# Altium project SVPXGR740_3U.PrjPcb (part 4 of 8)

## Sheet SDRAM.SchDoc
size A3
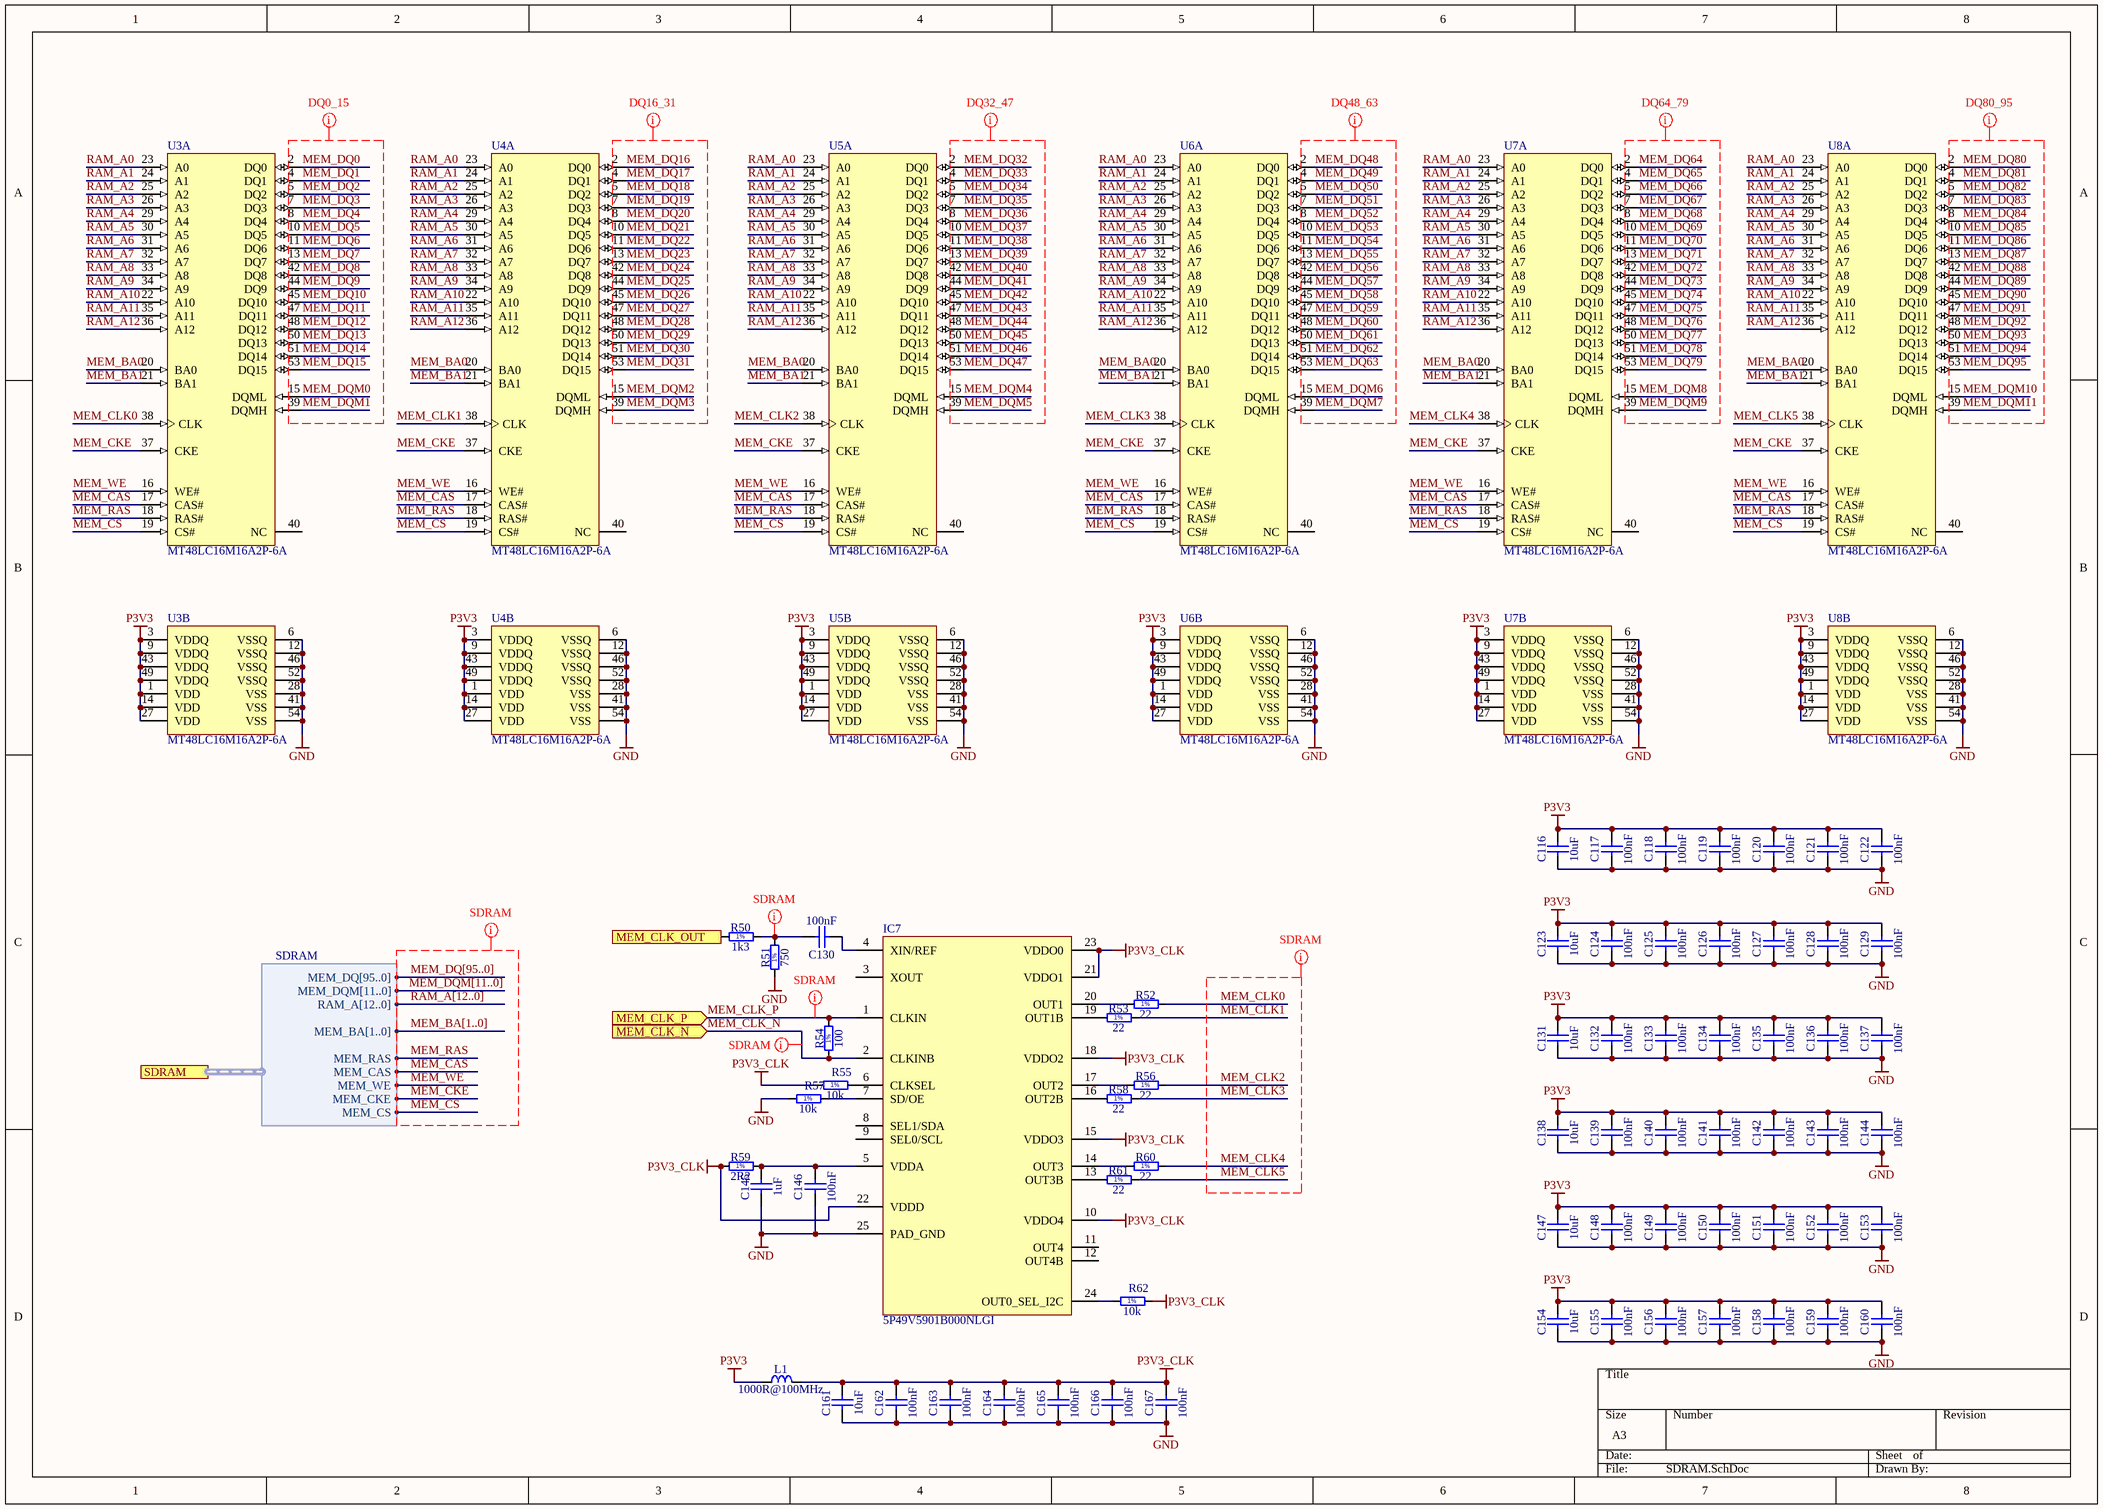
[diagram p11: SDRAM.SchDoc]

### Parts
C116  10uF  [CAPC2012X135N]
C117  100nF  [CAPC0603X33N]
C118  100nF  [CAPC0603X33N]
C119  100nF  [CAPC0603X33N]
C120  100nF  [CAPC0603X33N]
C121  100nF  [CAPC0603X33N]
C122  100nF  [CAPC0603X33N]
C123  10uF  [CAPC2012X135N]
C124  100nF  [CAPC0603X33N]
C125  100nF  [CAPC0603X33N]
C126  100nF  [CAPC0603X33N]
C127  100nF  [CAPC0603X33N]
C128  100nF  [CAPC0603X33N]
C129  100nF  [CAPC0603X33N]
C130  100nF  [CAPC0603X33N]
C131  10uF  [CAPC2012X135N]
C132  100nF  [CAPC0603X33N]
C133  100nF  [CAPC0603X33N]
C134  100nF  [CAPC0603X33N]
C135  100nF  [CAPC0603X33N]
C136  100nF  [CAPC0603X33N]
C137  100nF  [CAPC0603X33N]
C138  10uF  [CAPC2012X135N]
C139  100nF  [CAPC0603X33N]
C140  100nF  [CAPC0603X33N]
C141  100nF  [CAPC0603X33N]
C142  100nF  [CAPC0603X33N]
C143  100nF  [CAPC0603X33N]
C144  100nF  [CAPC0603X33N]
C145  1uF  [CAPC1005X55N]
C146  100nF  [CAPC0603X33N]
C147  10uF  [CAPC2012X135N]
C148  100nF  [CAPC0603X33N]
C149  100nF  [CAPC0603X33N]
C150  100nF  [CAPC0603X33N]
C151  100nF  [CAPC0603X33N]
C152  100nF  [CAPC0603X33N]
C153  100nF  [CAPC0603X33N]
C154  10uF  [CAPC2012X135N]
C155  100nF  [CAPC0603X33N]
C156  100nF  [CAPC0603X33N]
C157  100nF  [CAPC0603X33N]
C158  100nF  [CAPC0603X33N]
C159  100nF  [CAPC0603X33N]
C160  100nF  [CAPC0603X33N]
C161  10uF  [CAPC2012X135N]
C162  100nF  [CAPC0603X33N]
C163  100nF  [CAPC0603X33N]
C164  100nF  [CAPC0603X33N]
C165  100nF  [CAPC0603X33N]
C166  100nF  [CAPC0603X33N]
C167  100nF  [CAPC0603X33N]
IC7  5P49V5901B000NLGI  [QFN50P400X400X100-25N-S280]
L1  1000R@100MHz  [INDC1608X95N]
R50  1k3  [RESC1005X40N]
R51  750  [RESC1005X40N]
R52  22  [RESC1005X40N]
R53  22  [RESC1005X40N]
R54  100  [RESC1005X40N]
R55  10k  [RESC1005X40N]
R56  22  [RESC1005X40N]
R57  10k  [RESC1005X40N]
R58  22  [RESC1005X40N]
R59  2R2  [RESC1005X40N]
R60  22  [RESC1005X40N]
R61  22  [RESC1005X40N]
R62  10k  [RESC1005X40N]
U3  MT48LC16M16A2P-6A  [MICT-P-54_N]  (parts A,B of 2)
U4  MT48LC16M16A2P-6A  [MICT-P-54_N]  (parts A,B of 2)
U5  MT48LC16M16A2P-6A  [MICT-P-54_N]  (parts A,B of 2)
U6  MT48LC16M16A2P-6A  [MICT-P-54_N]  (parts A,B of 2)
U7  MT48LC16M16A2P-6A  [MICT-P-54_N]  (parts A,B of 2)
U8  MT48LC16M16A2P-6A  [MICT-P-54_N]  (parts A,B of 2)

### Ports
MEM_CLK_N (in), MEM_CLK_OUT (in), MEM_CLK_P (in), SDRAM (harness SDRAM)

### Harnesses
SDRAM: MEM_DQ[95..0], MEM_DQM[11..0], RAM_A[12..0], MEM_BA[1..0], MEM_RAS, MEM_CAS, MEM_WE, MEM_CKE, MEM_CS

### Nets
GND: C116.1 C117.2 C118.2 C119.2 C120.2 C121.2 C122.2 C123.1 C124.2 C125.2 C126.2 C127.2 C128.2 C129.2 C131.1 C132.2 C133.2 C134.2 C135.2 C136.2 C137.2 C138.1 C139.2 C140.2 C141.2 C142.2 C143.2 C144.2 C145.1 C146.2 C147.1 C148.2 C149.2 C150.2 C151.2 C152.2 C153.2 C154.1 C155.2 C156.2 C157.2 C158.2 C159.2 C160.2 C161.1 C162.2 C163.2 C164.2 C165.2 C166.2 C167.2 IC7.25(PAD_GND) R51.1 R57.1 U3.6(VSSQ) U3.12(VSSQ) U3.28(VSS) U3.41(VSS) U3.46(VSSQ) U3.52(VSSQ) U3.54(VSS) U4.6(VSSQ) U4.12(VSSQ) U4.28(VSS) U4.41(VSS) U4.46(VSSQ) U4.52(VSSQ) U4.54(VSS) U5.6(VSSQ) U5.12(VSSQ) U5.28(VSS) U5.41(VSS) U5.46(VSSQ) U5.52(VSSQ) U5.54(VSS) U6.6(VSSQ) U6.12(VSSQ) U6.28(VSS) U6.41(VSS) U6.46(VSSQ) U6.52(VSSQ) U6.54(VSS) U7.6(VSSQ) U7.12(VSSQ) U7.28(VSS) U7.41(VSS) U7.46(VSSQ) U7.52(VSSQ) U7.54(VSS) U8.6(VSSQ) U8.12(VSSQ) U8.28(VSS) U8.41(VSS) U8.46(VSSQ) U8.52(VSSQ) U8.54(VSS)
P3V3: C116.2 C117.1 C118.1 C119.1 C120.1 C121.1 C122.1 C123.2 C124.1 C125.1 C126.1 C127.1 C128.1 C129.1 C131.2 C132.1 C133.1 C134.1 C135.1 C136.1 C137.1 C138.2 C139.1 C140.1 C141.1 C142.1 C143.1 C144.1 C147.2 C148.1 C149.1 C150.1 C151.1 C152.1 C153.1 C154.2 C155.1 C156.1 C157.1 C158.1 C159.1 C160.1 L1.1 U3.1(VDD) U3.3(VDDQ) U3.9(VDDQ) U3.14(VDD) U3.27(VDD) U3.43(VDDQ) U3.49(VDDQ) U4.1(VDD) U4.3(VDDQ) U4.9(VDDQ) U4.14(VDD) U4.27(VDD) U4.43(VDDQ) U4.49(VDDQ) U5.1(VDD) U5.3(VDDQ) U5.9(VDDQ) U5.14(VDD) U5.27(VDD) U5.43(VDDQ) U5.49(VDDQ) U6.1(VDD) U6.3(VDDQ) U6.9(VDDQ) U6.14(VDD) U6.27(VDD) U6.43(VDDQ) U6.49(VDDQ) U7.1(VDD) U7.3(VDDQ) U7.9(VDDQ) U7.14(VDD) U7.27(VDD) U7.43(VDDQ) U7.49(VDDQ) U8.1(VDD) U8.3(VDDQ) U8.9(VDDQ) U8.14(VDD) U8.27(VDD) U8.43(VDDQ) U8.49(VDDQ)  [project net 3.3V]
P3V3_CLK: C161.2 C162.1 C163.1 C164.1 C165.1 C166.1 C167.1 IC7.10(VDDO4) IC7.15(VDDO3) IC7.18(VDDO2) IC7.21(VDDO1) IC7.22(VDDD) IC7.23(VDDO0) L1.2 R55.1 R59.1 R62.2
MEM_BA0: U3.20(BA0) U4.20(BA0) U5.20(BA0) U6.20(BA0) U7.20(BA0) U8.20(BA0)
MEM_BA1: U3.21(BA1) U4.21(BA1) U5.21(BA1) U6.21(BA1) U7.21(BA1) U8.21(BA1)
MEM_CAS: U3.17(CAS#) U4.17(CAS#) U5.17(CAS#) U6.17(CAS#) U7.17(CAS#) U8.17(CAS#) ; port SDRAM.MEM_CAS
MEM_CKE: U3.37(CKE) U4.37(CKE) U5.37(CKE) U6.37(CKE) U7.37(CKE) U8.37(CKE) ; port SDRAM.MEM_CKE
MEM_CLK0: R52.2 U3.38(CLK)
MEM_CLK1: R53.2 U4.38(CLK)
MEM_CLK2: R56.2 U5.38(CLK)
MEM_CLK3: R58.2 U6.38(CLK)
MEM_CLK4: R60.2 U7.38(CLK)
MEM_CLK5: R61.2 U8.38(CLK)
MEM_CLK_N: IC7.2(CLKINB) R54.1 ; port MEM_CLK_N
MEM_CLK_OUT: R50.1 ; port MEM_CLK_OUT
MEM_CLK_P: IC7.1(CLKIN) R54.2 ; port MEM_CLK_P
MEM_CS: U3.19(CS#) U4.19(CS#) U5.19(CS#) U6.19(CS#) U7.19(CS#) U8.19(CS#) ; port SDRAM.MEM_CS
MEM_DQ0: U3.2(DQ0)
MEM_DQ1: U3.4(DQ1)
MEM_DQ2: U3.5(DQ2)
MEM_DQ3: U3.7(DQ3)
MEM_DQ4: U3.8(DQ4)
MEM_DQ5: U3.10(DQ5)
MEM_DQ6: U3.11(DQ6)
MEM_DQ7: U3.13(DQ7)
MEM_DQ8: U3.42(DQ8)
MEM_DQ9: U3.44(DQ9)
MEM_DQ10: U3.45(DQ10)
MEM_DQ11: U3.47(DQ11)
MEM_DQ12: U3.48(DQ12)
MEM_DQ13: U3.50(DQ13)
MEM_DQ14: U3.51(DQ14)
MEM_DQ15: U3.53(DQ15)
MEM_DQ16: U4.2(DQ0)
MEM_DQ17: U4.4(DQ1)
MEM_DQ18: U4.5(DQ2)
MEM_DQ19: U4.7(DQ3)
MEM_DQ20: U4.8(DQ4)
MEM_DQ21: U4.10(DQ5)
MEM_DQ22: U4.11(DQ6)
MEM_DQ23: U4.13(DQ7)
MEM_DQ24: U4.42(DQ8)
MEM_DQ25: U4.44(DQ9)
MEM_DQ26: U4.45(DQ10)
MEM_DQ27: U4.47(DQ11)
MEM_DQ28: U4.48(DQ12)
MEM_DQ29: U4.50(DQ13)
MEM_DQ30: U4.51(DQ14)
MEM_DQ31: U4.53(DQ15)
MEM_DQ32: U5.2(DQ0)
MEM_DQ33: U5.4(DQ1)
MEM_DQ34: U5.5(DQ2)
MEM_DQ35: U5.7(DQ3)
MEM_DQ36: U5.8(DQ4)
MEM_DQ37: U5.10(DQ5)
MEM_DQ38: U5.11(DQ6)
MEM_DQ39: U5.13(DQ7)
MEM_DQ40: U5.42(DQ8)
MEM_DQ41: U5.44(DQ9)
MEM_DQ42: U5.45(DQ10)
MEM_DQ43: U5.47(DQ11)
MEM_DQ44: U5.48(DQ12)
MEM_DQ45: U5.50(DQ13)
MEM_DQ46: U5.51(DQ14)
MEM_DQ47: U5.53(DQ15)
MEM_DQ48: U6.2(DQ0)
MEM_DQ49: U6.4(DQ1)
MEM_DQ50: U6.5(DQ2)
MEM_DQ51: U6.7(DQ3)
MEM_DQ52: U6.8(DQ4)
MEM_DQ53: U6.10(DQ5)
MEM_DQ54: U6.11(DQ6)
MEM_DQ55: U6.13(DQ7)
MEM_DQ56: U6.42(DQ8)
MEM_DQ57: U6.44(DQ9)
MEM_DQ58: U6.45(DQ10)
MEM_DQ59: U6.47(DQ11)
MEM_DQ60: U6.48(DQ12)
MEM_DQ61: U6.50(DQ13)
MEM_DQ62: U6.51(DQ14)
MEM_DQ63: U6.53(DQ15)
MEM_DQ64: U7.2(DQ0)
MEM_DQ65: U7.4(DQ1)
MEM_DQ66: U7.5(DQ2)
MEM_DQ67: U7.7(DQ3)
MEM_DQ68: U7.8(DQ4)
MEM_DQ69: U7.10(DQ5)
MEM_DQ70: U7.11(DQ6)
MEM_DQ71: U7.13(DQ7)
MEM_DQ72: U7.42(DQ8)
MEM_DQ73: U7.44(DQ9)
MEM_DQ74: U7.45(DQ10)
MEM_DQ75: U7.47(DQ11)
MEM_DQ76: U7.48(DQ12)
MEM_DQ77: U7.50(DQ13)
MEM_DQ78: U7.51(DQ14)
MEM_DQ79: U7.53(DQ15)
MEM_DQ80: U8.2(DQ0)
MEM_DQ81: U8.4(DQ1)
MEM_DQ82: U8.5(DQ2)
MEM_DQ83: U8.7(DQ3)
MEM_DQ84: U8.8(DQ4)
MEM_DQ85: U8.10(DQ5)
MEM_DQ86: U8.11(DQ6)
MEM_DQ87: U8.13(DQ7)
MEM_DQ88: U8.42(DQ8)
MEM_DQ89: U8.44(DQ9)
MEM_DQ90: U8.45(DQ10)
MEM_DQ91: U8.47(DQ11)
MEM_DQ92: U8.48(DQ12)
MEM_DQ93: U8.50(DQ13)
MEM_DQ94: U8.51(DQ14)
MEM_DQ95: U8.53(DQ15)
MEM_DQM0: U3.15(DQML)
MEM_DQM1: U3.39(DQMH)
MEM_DQM2: U4.15(DQML)
MEM_DQM3: U4.39(DQMH)
MEM_DQM4: U5.15(DQML)
MEM_DQM5: U5.39(DQMH)
MEM_DQM6: U6.15(DQML)
MEM_DQM7: U6.39(DQMH)
MEM_DQM8: U7.15(DQML)
MEM_DQM9: U7.39(DQMH)
MEM_DQM10: U8.15(DQML)
MEM_DQM11: U8.39(DQMH)
MEM_RAS: U3.18(RAS#) U4.18(RAS#) U5.18(RAS#) U6.18(RAS#) U7.18(RAS#) U8.18(RAS#) ; port SDRAM.MEM_RAS
MEM_WE: U3.16(WE#) U4.16(WE#) U5.16(WE#) U6.16(WE#) U7.16(WE#) U8.16(WE#) ; port SDRAM.MEM_WE
RAM_A0: U3.23(A0) U4.23(A0) U5.23(A0) U6.23(A0) U7.23(A0) U8.23(A0)
RAM_A1: U3.24(A1) U4.24(A1) U5.24(A1) U6.24(A1) U7.24(A1) U8.24(A1)
RAM_A2: U3.25(A2) U4.25(A2) U5.25(A2) U6.25(A2) U7.25(A2) U8.25(A2)
RAM_A3: U3.26(A3) U4.26(A3) U5.26(A3) U6.26(A3) U7.26(A3) U8.26(A3)
RAM_A4: U3.29(A4) U4.29(A4) U5.29(A4) U6.29(A4) U7.29(A4) U8.29(A4)
RAM_A5: U3.30(A5) U4.30(A5) U5.30(A5) U6.30(A5) U7.30(A5) U8.30(A5)
RAM_A6: U3.31(A6) U4.31(A6) U5.31(A6) U6.31(A6) U7.31(A6) U8.31(A6)
RAM_A7: U3.32(A7) U4.32(A7) U5.32(A7) U6.32(A7) U7.32(A7) U8.32(A7)
RAM_A8: U3.33(A8) U4.33(A8) U5.33(A8) U6.33(A8) U7.33(A8) U8.33(A8)
RAM_A9: U3.34(A9) U4.34(A9) U5.34(A9) U6.34(A9) U7.34(A9) U8.34(A9)
RAM_A10: U3.22(A10) U4.22(A10) U5.22(A10) U6.22(A10) U7.22(A10) U8.22(A10)
RAM_A11: U3.35(A11) U4.35(A11) U5.35(A11) U6.35(A11) U7.35(A11) U8.35(A11)
RAM_A12: U3.36(A12) U4.36(A12) U5.36(A12) U6.36(A12) U7.36(A12) U8.36(A12)
NetC130_1: C130.1 R50.2 R51.2
NetC130_2: C130.2 IC7.4(XIN/REF)
NetC145_2: C145.2 C146.1 IC7.5(VDDA) R59.2
NetIC7_6: IC7.6(CLKSEL) R55.2
NetIC7_7: IC7.7(SD/OE) R57.2
NetIC7_13: IC7.13(OUT3B) R61.1
NetIC7_14: IC7.14(OUT3) R60.1
NetIC7_16: IC7.16(OUT2B) R58.1
NetIC7_17: IC7.17(OUT2) R56.1
NetIC7_19: IC7.19(OUT1B) R53.1
NetIC7_20: IC7.20(OUT1) R52.1
NetIC7_24: IC7.24(OUT0_SEL_I2C) R62.1

Not connected (* = marked no-connect by the designer): IC7 3(XOUT) 8(SEL1/SDA) 9(SEL0/SCL) 11(OUT4) 12(OUT4B); U3 40(NC); U4 40(NC); U5 40(NC); U6 40(NC); U7 40(NC); U8 40(NC)

### Buses and harness runs
bus MEM_BA[1..0]
bus MEM_DQ[95..0]
bus MEM_DQM[11..0]
bus RAM_A[12..0]

### Layout directives
net class DQ0_15: MEM_DQ0, MEM_DQ1, MEM_DQ2, MEM_DQ3, MEM_DQ4, MEM_DQ5, MEM_DQ6, MEM_DQ7, MEM_DQ8, MEM_DQ9, MEM_DQ10, MEM_DQ11, MEM_DQ12, MEM_DQ13, MEM_DQ14, MEM_DQ15, MEM_DQM0, MEM_DQM1
net class DQ16_31: MEM_DQ16, MEM_DQ17, MEM_DQ18, MEM_DQ19, MEM_DQ20, MEM_DQ21, MEM_DQ22, MEM_DQ23, MEM_DQ24, MEM_DQ25, MEM_DQ26, MEM_DQ27, MEM_DQ28, MEM_DQ29, MEM_DQ30, MEM_DQ31, MEM_DQM2, MEM_DQM3
net class DQ32_47: MEM_DQ32, MEM_DQ33, MEM_DQ34, MEM_DQ35, MEM_DQ36, MEM_DQ37, MEM_DQ38, MEM_DQ39, MEM_DQ40, MEM_DQ41, MEM_DQ42, MEM_DQ43, MEM_DQ44, MEM_DQ45, MEM_DQ46, MEM_DQ47, MEM_DQM4, MEM_DQM5
net class DQ48_63: MEM_DQ48, MEM_DQ49, MEM_DQ50, MEM_DQ51, MEM_DQ52, MEM_DQ53, MEM_DQ54, MEM_DQ55, MEM_DQ56, MEM_DQ57, MEM_DQ58, MEM_DQ59, MEM_DQ60, MEM_DQ61, MEM_DQ62, MEM_DQ63, MEM_DQM6, MEM_DQM7
net class DQ64_79: MEM_DQ64, MEM_DQ65, MEM_DQ66, MEM_DQ67, MEM_DQ68, MEM_DQ69, MEM_DQ70, MEM_DQ71, MEM_DQ72, MEM_DQ73, MEM_DQ74, MEM_DQ75, MEM_DQ76, MEM_DQ77, MEM_DQ78, MEM_DQ79, MEM_DQM8, MEM_DQM9
net class DQ80_95: MEM_DQ80, MEM_DQ81, MEM_DQ82, MEM_DQ83, MEM_DQ84, MEM_DQ85, MEM_DQ86, MEM_DQ87, MEM_DQ88, MEM_DQ89, MEM_DQ90, MEM_DQ91, MEM_DQ92, MEM_DQ93, MEM_DQ94, MEM_DQ95, MEM_DQM10, MEM_DQM11
rule Width Constraint [Pref Impedance = 50.00ohms    Min Impedance = 50.00ohms    Max Impedance = 50.00ohms]; net class SDRAM: MEM_BA[1..0], MEM_CAS, MEM_CKE, MEM_CLK0, MEM_CLK1, MEM_CLK2, MEM_CLK3, MEM_CLK4, MEM_CLK5, MEM_CLK_N, MEM_CLK_P, MEM_CS, MEM_DQ[95..0], MEM_DQM[11..0], MEM_RAS, MEM_WE, NetC130_1, RAM_A[12..0]

### Notes on the sheet
- (in symbol R0402_1K3_1%_0.0625W_100PPM) 1%
- (in symbol R0402_2R2_1%_0.0625W_200PPM) 1%
- (in symbol R0402_10K_1%_0.0625W_100PPM) 1%
- (in symbol R0402_22R_1%_0.0625W_100PPM) 1%
- (in symbol R0402_100R_1%_0.0625W_100PPM) 1%
- (in symbol R0402_750R_1%_0.0625W_100PPM) 1%

### Library data of the parts
C116 C123 C131 C138 C147 C154 C161 = CC0805_10UF_16V_10%_X5R: as C46 on sheet GR740_Power; Part Number: CC0805_10UF_16V_10%_X5R; Component Kind: Standard; Component Type: Standard; Pin Count: 2; Value: 10uF; Status: Preferred; Manufacturer Part Number: CC0805_10UF_16V_10%_X5R; Case: 0805; Mounted: Yes; Socket: No; SMD: Yes; Sense: No; Manufacturer1 Example: KEMET; Manufacturer1 ComponentHeight: 1.4mm; HelpURL: \\cern.ch\dfs\Applications\Altium\Datasheets\CC1206_X5R_KEMET.pdf; Author: CERN DEM JLC; CreateDate: 03.12.2007; LatestRevisionDate: 03.12.2007
C117-C122 C124-C130 C132-C137 C139-C144 C146 C148-C153 C155-C160 C162-C167 = CC0201_100NF_6.3V_10%_X5R: as C15 on sheet GR740_Power; Part Number: CC0201_100NF_6.3V_10%_X5R; Component Kind: Standard; Component Type: Standard; Pin Count: 2; Value: 100nF; Status: Not Recommended; Manufacturer Part Number: CC0201_100NF_6.3V_10%_X5R; Case: 0201; Mounted: Yes; Socket: No; SMD: Yes; Sense: No; Manufacturer1 Example: AVX; Manufacturer1 ComponentHeight: 0.33mm; HelpURL: \\cern.ch\dfs\Applications\Altium\Datasheets\CC0201_X5R_AVX.pdf; Author: CERN DEM JLC; CreateDate: 03/12/2007; LatestRevisionDate: 03/12/2007
C145 = CC0402_1UF_16V_10%_X5R: Non-polarised capacitor; Part Description: SMD Multilayer Chip Ceramic Capacitor; Manufacturer: GENERIC; Manufacturer1 Part Number: C1005X5R1C105KT; Voltage: 16V; TC: X5R; Tolerance: ±10%; Part Number: CC0402_1UF_16V_10%_X5R; Component Kind: Standard; Component Type: Standard; Pin Count: 2; Value: 1uF; Status: Preferred; Manufacturer Part Number: CC0402_1UF_16V_10%_X5R; Case: 0402; Mounted: Yes; Socket: No; SMD: Yes; Sense: No; Manufacturer1 Example: TDK; Manufacturer1 ComponentHeight: 0.55mm; HelpURL: \\cern.ch\dfs\Applications\Altium\Datasheets\CC0402_X5R_TDK_C.pdf; Author: CERN DEM JLC; CreateDate: 25.10.2012; LatestRevisionDate: 25.10.2012
L1 = IND0603_MURATA_BLM18HE102SN1: Inductor; Part Description: SMD EMIFIL Suppression Chip Ferrite Bead; Manufacturer: MURATA; Power: 600mA; Resistance: 0.35R; Tolerance: ±25%; Part Number: IND0603_MURATA_BLM18HE102SN1; Component Kind: Standard; Component Type: Standard; Pin Count: 2; Value: 1000R@100MHz; Status: None; Manufacturer Part Number: BLM18HE102SN1; Case: 0603; Mounted: Yes; Socket: No; SMD: Yes; Sense: No; ComponentHeight: 0.95mm; HelpURL: \\cern.ch\dfs\Applications\Altium\Datasheets\IND0603_MURATA_BLM18H.pdf; Author: CERN DEM JLC; CreateDate: 09/12/2013; LatestRevisionDate: 09/12/2013
R50 = R0402_1K3_1%_0.0625W_100PPM: Resistor - 1%; Part Description: General Purpose Thick Film Chip Resistor; Manufacturer: GENERIC; Manufacturer1 Part Number: 232270671302L; TC: ±100ppm/°C; PressFit: No; Part Number: R0402_1K3_1%_0.0625W_100PPM; Component Kind: Standard; Component Type: Standard; Pin Count: 2; Value: 1k3; Status: Not Recommended; Power: 0.0625W; Tolerance: ±1%; Manufacturer Part Number: R0402_1K3_1%_0.0625W_100PPM; Case: 0402; Mounted: Yes; Sense: No; Socket: No; SMD: Yes; Manufacturer1 Example: YAGEO PHYCOMP; Manufacturer1 ComponentHeight: 0.4mm; HelpURL: \\cern.ch\dfs\Applications\Altium\Datasheets\R0402_Phycomp_RC0402.pdf; Author: CERN DEM JLC; CreateDate: 03.12.2007; LatestRevisionDate: 17.10.2012
R51 = R0402_750R_1%_0.0625W_100PPM: Resistor - 1%; Part Description: General Purpose Thick Film Chip Resistor; Manufacturer: GENERIC; Manufacturer1 Part Number: 232270677501L; TC: ±100ppm/°C; PressFit: No; Part Number: R0402_750R_1%_0.0625W_100PPM; Component Kind: Standard; Component Type: Standard; Pin Count: 2; Value: 750; Status: Not Recommended; Power: 0.0625W; Tolerance: ±1%; Manufacturer Part Number: R0402_750R_1%_0.0625W_100PPM; Case: 0402; Mounted: Yes; Sense: No; Socket: No; SMD: Yes; Manufacturer1 Example: YAGEO PHYCOMP; Manufacturer1 ComponentHeight: 0.4mm; HelpURL: \\cern.ch\dfs\Applications\Altium\Datasheets\R0402_Phycomp_RC0402.pdf; Author: CERN DEM JLC; CreateDate: 03.12.2007; LatestRevisionDate: 17.10.2012
R52 R53 R56 R58 R60 R61 = R0402_22R_1%_0.0625W_100PPM: Resistor - 1%; Part Description: General Purpose Thick Film Chip Resistor; Manufacturer: GENERIC; Manufacturer1 Part Number: 232270672209L; TC: ±100ppm/°C; PressFit: No; Part Number: R0402_22R_1%_0.0625W_100PPM; Component Kind: Standard; Component Type: Standard; Pin Count: 2; Value: 22; Status: Not Recommended; Power: 0.0625W; Tolerance: ±1%; Manufacturer Part Number: R0402_22R_1%_0.0625W_100PPM; Case: 0402; Mounted: Yes; Sense: No; Socket: No; SMD: Yes; Manufacturer1 Example: YAGEO PHYCOMP; Manufacturer1 ComponentHeight: 0.4mm; HelpURL: \\cern.ch\dfs\Applications\Altium\Datasheets\R0402_Phycomp_RC0402.pdf; Author: CERN DEM JLC; CreateDate: 03.12.2007; LatestRevisionDate: 17.10.2012
R54 = R0402_100R_1%_0.0625W_100PPM: Resistor - 1%; Part Description: General Purpose Thick Film Chip Resistor; Manufacturer: GENERIC; Manufacturer1 Part Number: 232270671001L; TC: ±100ppm/°C; PressFit: No; Part Number: R0402_100R_1%_0.0625W_100PPM; Component Kind: Standard; Component Type: Standard; Pin Count: 2; Value: 100; Status: Not Recommended; Power: 0.0625W; Tolerance: ±1%; Manufacturer Part Number: R0402_100R_1%_0.0625W_100PPM; Case: 0402; Mounted: Yes; Sense: No; Socket: No; SMD: Yes; Manufacturer1 Example: YAGEO PHYCOMP; Manufacturer1 ComponentHeight: 0.4mm; HelpURL: \\cern.ch\dfs\Applications\Altium\Datasheets\R0402_Phycomp_RC0402.pdf; Author: CERN DEM JLC; CreateDate: 03.12.2007; LatestRevisionDate: 17.10.2012
R55 R57 R62 = R0402_10K_1%_0.0625W_100PPM: Resistor - 1%; Manufacturer: GENERIC; Part Description: General Purpose Thick Film Chip Resistor; Manufacturer1 Part Number: 232270671003L; TC: ±100ppm/°C; PressFit: No; Manufacturer Part Number: R0402_10K_1%_0.0625W_100PPM; Part Number: R0402_10K_1%_0.0625W_100PPM; Tolerance: ±1%; Value: 10k; Component Kind: Standard; Component Type: Standard; Pin Count: 2; Status: Not Recommended; Power: 0.0625W; Case: 0402; Mounted: Yes; Sense: No; Socket: No; SMD: Yes; Manufacturer1 Example: YAGEO PHYCOMP; Manufacturer1 ComponentHeight: 0.4mm; HelpURL: \\cern.ch\dfs\Applications\Altium\Datasheets\R0402_Phycomp_RC0402.pdf; Author: CERN DEM JLC; CreateDate: 03/12/2007; LatestRevisionDate: 17/10/2012
R59 = R0402_2R2_1%_0.0625W_200PPM: Resistor - 1%; Part Description: General Purpose Thick Film Chip Resistor; Manufacturer: GENERIC; Manufacturer1 Part Number: 232270672208L; TC: ±200ppm/°C; PressFit: No; Part Number: R0402_2R2_1%_0.0625W_200PPM; Component Kind: Standard; Component Type: Standard; Pin Count: 2; Value: 2R2; Status: Not Recommended; Power: 0.0625W; Tolerance: ±1%; Manufacturer Part Number: R0402_2R2_1%_0.0625W_200PPM; Case: 0402; Mounted: Yes; Sense: No; Socket: No; SMD: Yes; Manufacturer1 Example: YAGEO PHYCOMP; Manufacturer1 ComponentHeight: 0.4mm; HelpURL: \\cern.ch\dfs\Applications\Altium\Datasheets\R0402_Phycomp_RC0402.pdf; Author: CERN DEM JLC; CreateDate: 03.12.2007; LatestRevisionDate: 17.10.2012
U3-U8 = CMP-0351-00100-1: 256Mb PC133 SDR SDRAM, 16Mb x 16, 6ns, 3.3V, 0 to 70 degC, 54-Pin TSOP, Pb-Free; Manufacturer: Micron; CL: CL = 3Â; Density: 256MbÂ; Op. Temp.: 0C to +70CÂ; Clock Rate: 167 MHzÂ; Cycle Time: 6nsÂ; Data Rate: PC133Â; Voltage: 3.3VÂ; ComponentLink1URL: http://www.micron.com/; Mounting Technology: Surface Mount; ComponentLink3Description: Package Specification; Depth: 16MbÂ; ComponentLink3URL: http://www.micron.com/~/media/Documents/Products/Data%20Sheet/DRAM/128mb_x4x8x16_sdram.pdf; DatasheetVersion: Rev.Q; PartNumber: MT48LC16M16A2P-6A; PackageVersion: Rev.Q; ComponentLink2URL: http://www.micron.com/~/media/Documents/Products/Data%20Sheet/DRAM/256Mb_sdr.pdf; PackageReference: MICT-P-54; ComponentLink2Description: Datasheet; Width: x16Â; ComponentLink1Description: Manufacturer URL; PackageDescription: 54-Pin Thin Small Outline Package, 10.16 x 22.22 mm, Pitch 0.8 mm; RoHS: YesÂ

## Sheet Clocks.SchDoc
size A4
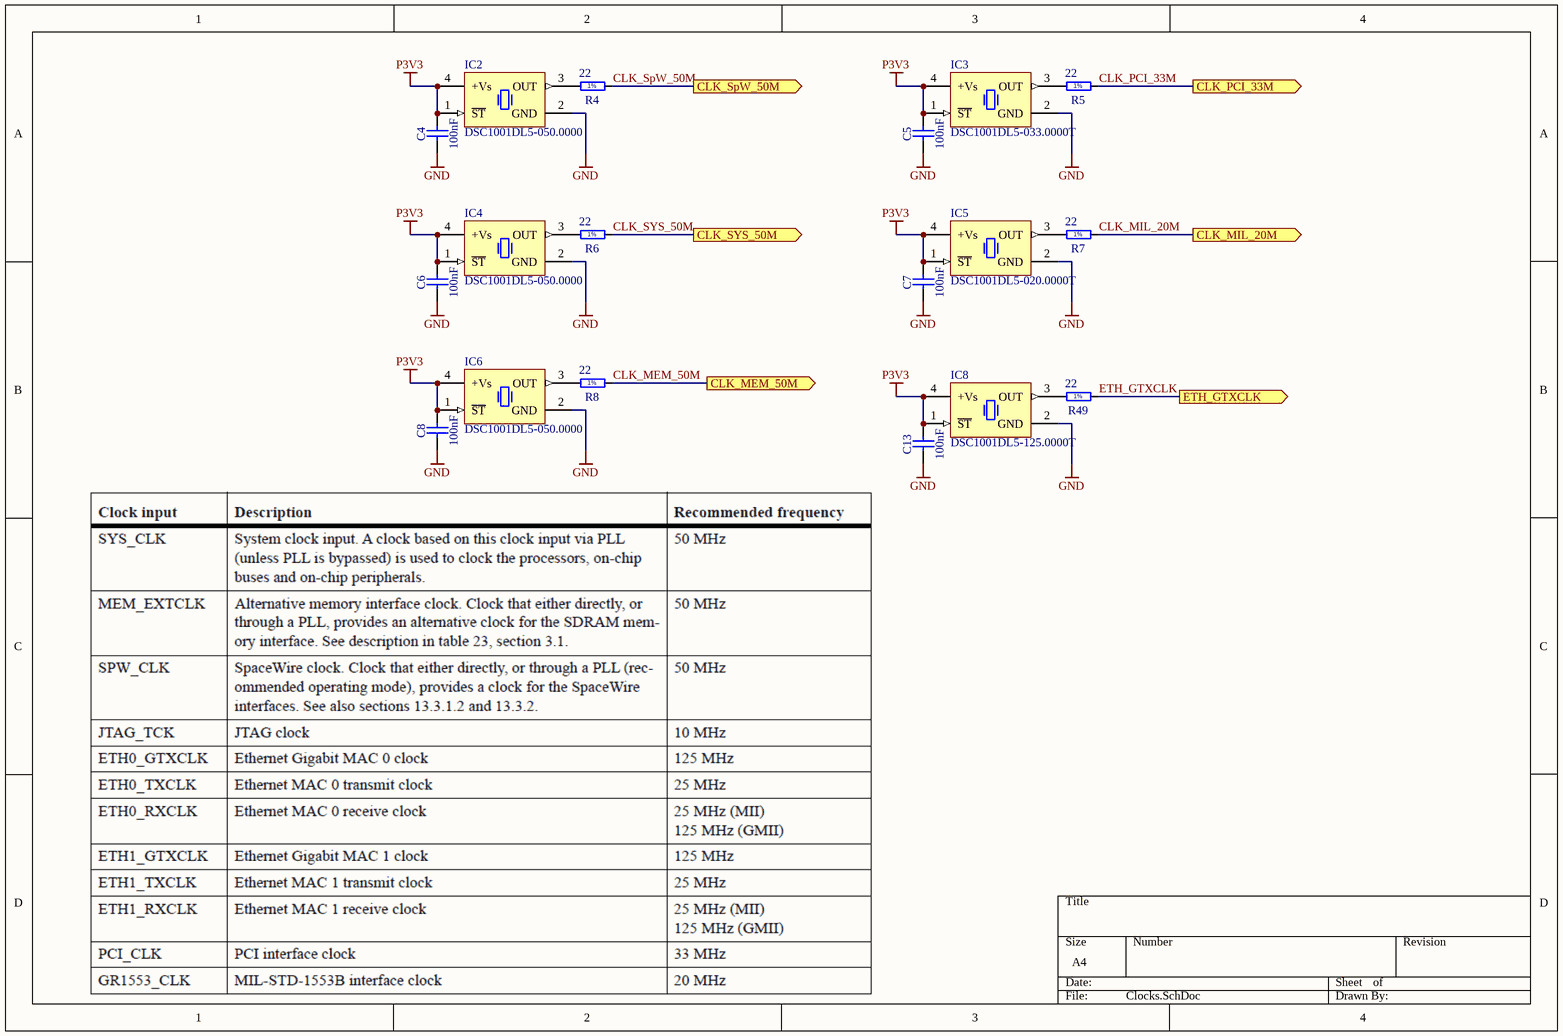
[diagram p12: Clocks.SchDoc]

### Parts
C4  100nF  [CAPC0603X33N]
C5  100nF  [CAPC0603X33N]
C6  100nF  [CAPC0603X33N]
C7  100nF  [CAPC0603X33N]
C8  100nF  [CAPC0603X33N]
C13  100nF  [CAPC0603X33N]
IC2  DSC1001DL5-050.0000  [OSC_MICREL_2520]
IC3  DSC1001DL5-033.0000T  [OSC_MICREL_2520]
IC4  DSC1001DL5-050.0000  [OSC_MICREL_2520]
IC5  DSC1001DL5-020.0000T  [OSC_MICREL_2520]
IC6  DSC1001DL5-050.0000  [OSC_MICREL_2520]
IC8  DSC1001DL5-125.0000T  [OSC_MICREL_2520]
R4  22  [RESC1005X40N]
R5  22  [RESC1005X40N]
R6  22  [RESC1005X40N]
R7  22  [RESC1005X40N]
R8  22  [RESC1005X40N]
R49  22  [RESC1005X40N]

### Ports
CLK_MEM_50M (out), CLK_MIL_20M (out), CLK_PCI_33M (out), CLK_SpW_50M (out), CLK_SYS_50M (out), ETH_GTXCLK (out)

### Nets
GND: C4.1 C5.1 C6.1 C7.1 C8.1 C13.1 IC2.2(GND) IC3.2(GND) IC4.2(GND) IC5.2(GND) IC6.2(GND) IC8.2(GND)
P3V3: C4.2 C5.2 C6.2 C7.2 C8.2 C13.2 IC2.1(~{ST}) IC2.4(+Vs) IC3.1(~{ST}) IC3.4(+Vs) IC4.1(~{ST}) IC4.4(+Vs) IC5.1(~{ST}) IC5.4(+Vs) IC6.1(~{ST}) IC6.4(+Vs) IC8.1(~{ST}) IC8.4(+Vs)  [project net 3.3V]
CLK_MEM_50M: R8.2 ; port CLK_MEM_50M
CLK_MIL_20M: R7.2 ; port CLK_MIL_20M
CLK_PCI_33M: R5.2 ; port CLK_PCI_33M  [project net X_CLK]
CLK_SpW_50M: R4.2 ; port CLK_SpW_50M
CLK_SYS_50M: R6.2 ; port CLK_SYS_50M
ETH_GTXCLK: R49.2 ; port ETH_GTXCLK
NetIC2_3: IC2.3(OUT) R4.1
NetIC3_3: IC3.3(OUT) R5.1
NetIC4_3: IC4.3(OUT) R6.1
NetIC5_3: IC5.3(OUT) R7.1
NetIC6_3: IC6.3(OUT) R8.1
NetIC8_3: IC8.3(OUT) R49.1

### Notes on the sheet
- (in symbol R0402_22R_1%_0.0625W_100PPM) 1%

### Library data of the parts
C4-C8 C13 = CC0201_100NF_6.3V_10%_X5R: as C15 on sheet GR740_Power; Part Number: CC0201_100NF_6.3V_10%_X5R; Component Kind: Standard; Component Type: Standard; Pin Count: 2; Value: 100nF; Status: Not Recommended; Manufacturer Part Number: CC0201_100NF_6.3V_10%_X5R; Case: 0201; Mounted: Yes; Socket: No; SMD: Yes; Sense: No; Manufacturer1 Example: AVX; Manufacturer1 ComponentHeight: 0.33mm; HelpURL: \\cern.ch\dfs\Applications\Altium\Datasheets\CC0201_X5R_AVX.pdf; Author: CERN DEM JLC; CreateDate: 03/12/2007; LatestRevisionDate: 03/12/2007
IC2 IC4 IC6 = OSC_DSC1001DL5-100.0000: MEMS 50MHz oscillator; Manufacturer: Micrel; Part Description: MEMS Oscillator 50MHz; Bonding: No; PressFit: No; Case: *; Component Kind: Standard; Component Type: Standard; ComponentHeigth: *; CreateDate: 2018-01-01; Device: DSC1001DL5-050.0000; Footprint: *; HelpURL: *; LatestRevisionDate: 2018-01-01; Manufacturer Part Number: DSC1001DL5-050.0000; Mounted: Yes; PackageDescription: MICREL SMD Oscillator, QFN, 4 pins, 2.5mm x 2.0mm; Part Number: DSC1001DL5-050.0000; Pin Count: 4; Sense: No; SMD: Yes; Socket: No; Value: *
IC3 = OSC_DSC1001DL5-100.0000: MEMS 33MHz oscillator; Manufacturer: Micrel; Part Description: MEMS Oscillator 33MHz; Bonding: No; PressFit: No; Case: *; Component Kind: Standard; Component Type: Standard; ComponentHeigth: *; CreateDate: 2018-01-01; Device: DSC1001DL5-033.0000T; Footprint: *; HelpURL: *; LatestRevisionDate: 2018-01-01; Manufacturer Part Number: DSC1001DL5-033.0000T; Mounted: Yes; PackageDescription: MICREL SMD Oscillator, QFN, 4 pins, 2.5mm x 2.0mm; Part Number: DSC1001DL5-033.0000T; Pin Count: 4; Sense: No; SMD: Yes; Socket: No; Value: *
IC5 = OSC_DSC1001DL5-100.0000: MEMS 20MHz oscillator; Manufacturer: Micrel; Part Description: MEMS Oscillator 20MHz; Bonding: No; PressFit: No; Case: *; Component Kind: Standard; Component Type: Standard; ComponentHeigth: *; CreateDate: 2018-01-01; Device: DSC1001DL5-020.0000T; Footprint: *; HelpURL: *; LatestRevisionDate: 2018-01-01; Manufacturer Part Number: DSC1001DL5-020.0000T; Mounted: Yes; PackageDescription: MICREL SMD Oscillator, QFN, 4 pins, 2.5mm x 2.0mm; Part Number: DSC1001DL5-020.0000T; Pin Count: 4; Sense: No; SMD: Yes; Socket: No; Value: *
IC8 = OSC_DSC1001DL5-100.0000: MEMS 125MHz oscillator; Manufacturer: Micrel; Part Description: MEMS Oscillator 125MHz; Bonding: No; PressFit: No; Case: *; Component Kind: Standard; Component Type: Standard; ComponentHeigth: *; CreateDate: 2018-01-01; Device: DSC1001DL5-125.0000T; Footprint: *; HelpURL: *; LatestRevisionDate: 2018-01-01; Manufacturer Part Number: DSC1001DL5-125.0000T; Mounted: Yes; PackageDescription: MICREL SMD Oscillator, QFN, 4 pins, 2.5mm x 2.0mm; Part Number: DSC1001DL5-125.0000T; Pin Count: 4; Sense: No; SMD: Yes; Socket: No; Value: *
R4-R8 R49 = R0402_22R_1%_0.0625W_100PPM: as R52 on sheet SDRAM; Part Number: R0402_22R_1%_0.0625W_100PPM; Component Kind: Standard; Component Type: Standard; Pin Count: 2; Value: 22; Status: Not Recommended; Power: 0.0625W; Tolerance: ±1%; Manufacturer Part Number: R0402_22R_1%_0.0625W_100PPM; Case: 0402; Mounted: Yes; Sense: No; Socket: No; SMD: Yes; Manufacturer1 Example: YAGEO PHYCOMP; Manufacturer1 ComponentHeight: 0.4mm; HelpURL: \\cern.ch\dfs\Applications\Altium\Datasheets\R0402_Phycomp_RC0402.pdf; Author: CERN DEM JLC; CreateDate: 03/12/2007; LatestRevisionDate: 17/10/2012